# Altium schematic sheet sch_substrate_board_pwr.SchDoc
size A4; SheetNumber: 2; SheetTotal: 6
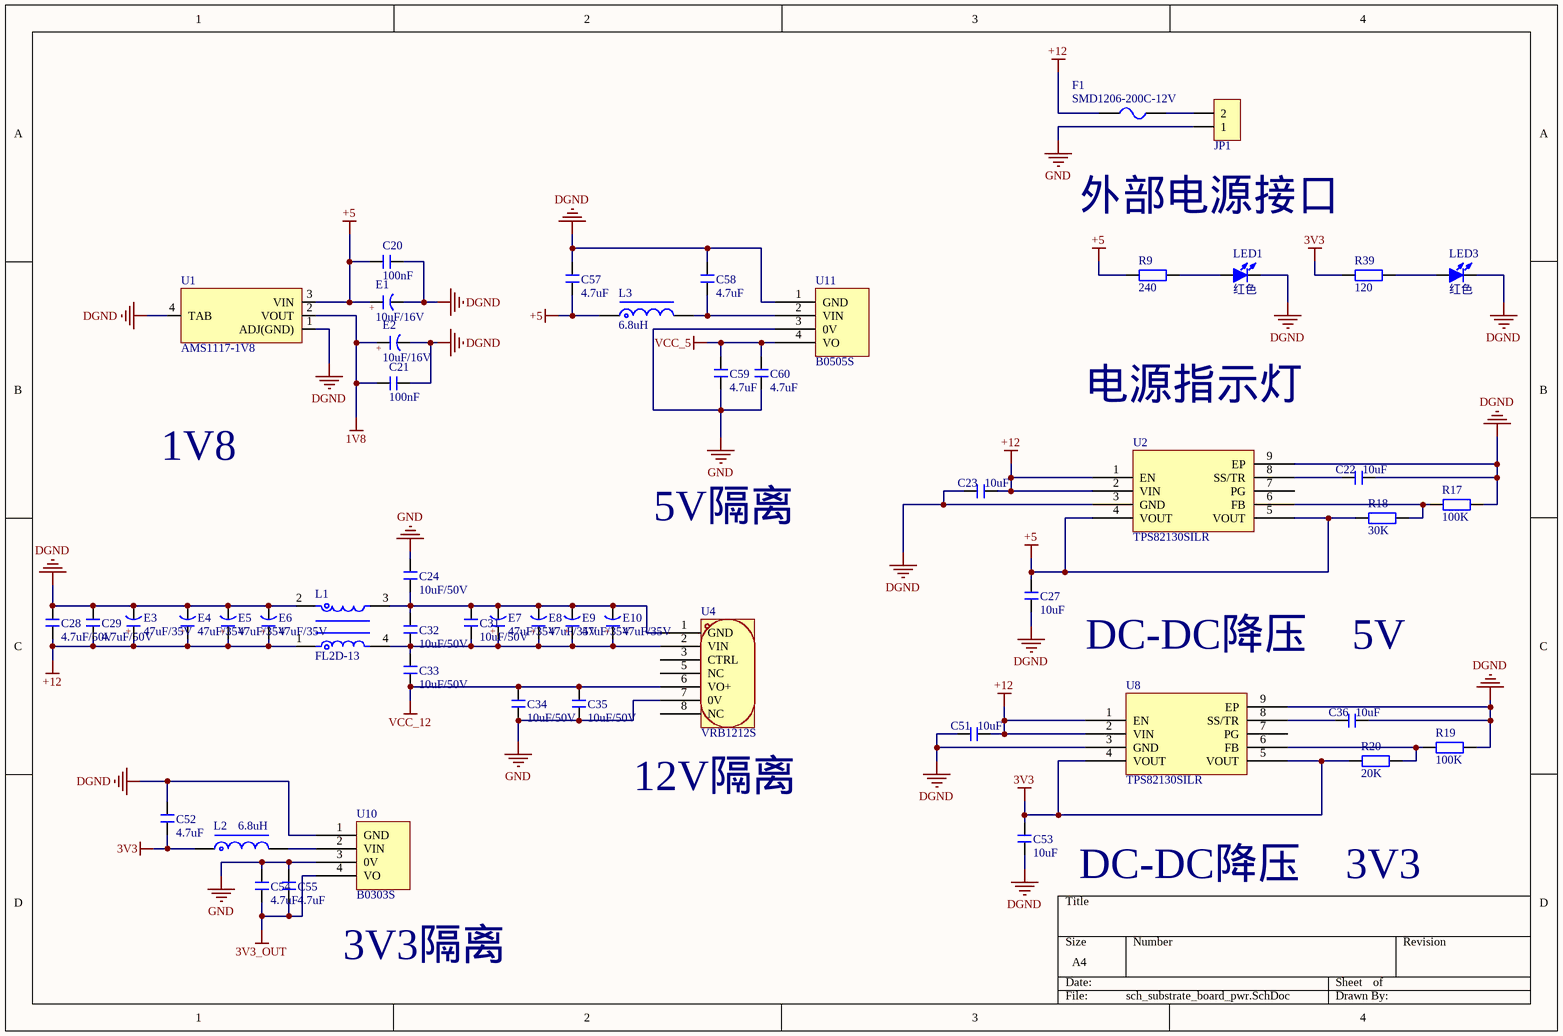
[diagram p0: sch_substrate_board_pwr.SchDoc]

## Parts
C20  100nF  [C 0805_L]
C21  100nF  [C 0805_L]
C22  10uF  [C 0805_L]
C23  10uF  [C 0805_L]
C24  10uF/50V  [CAP-SMD_L8.0-W6.0-LS11.4]
C27  10uF  [C 0805_L]
C28  4.7uF/50V  [C 0805_L]
C29  4.7uF/50V  [C 0805_L]
C31  10uF/50V  [C 0805_L]
C32  10uF/50V  [C 0805_L]
C33  10uF/50V  [CAP-SMD_L8.0-W6.0-LS11.4]
C34  10uF/50V  [C 0805_L]
C35  10uF/50V  [C 0805_L]
C36  10uF  [C 0805_L]
C51  10uF  [C 0805_L]
C52  4.7uF  [C 0805_L]
C53  10uF  [C 0805_L]
C54  4.7uF  [C 0805_L]
C55  4.7uF  [C 0805_L]
C57  4.7uF  [C 0805_L]
C58  4.7uF  [C 0805_L]
C59  4.7uF  [C 0805_L]
C60  4.7uF  [C 0805_L]
E1  10uF/16V  [CD A(3216)]
E2  10uF/16V  [CD A(3216)]
E3  47uF/35V  [CD D(7343)]
E4  47uF/35V  [CD D(7343)]
E5  47uF/35V  [CD D(7343)]
E6  47uF/35V  [CD D(7343)]
E7  47uF/35V  [CD D(7343)]
E8  47uF/35V  [CD D(7343)]
E9  47uF/35V  [CD D(7343)]
E10  47uF/35V  [CD D(7343)]
F1  SMD1206-200C-12V  [FU 1206]
JP1  HDR-1X2  [KF350-2P]  (value not drawn)
L1  FL2D-13  [FL2D-13]
L2  6.8uH  [- duplicate]
L3  6.8uH  [- duplicate]
LED1  红色  [LED 0805R]
LED3  红色  [LED 0805R]
R9  240  [R 0805_L]
R17  100K  [R 0805_L]
R18  30K  [R 0805_L]
R19  100K  [R 0805_L]
R20  20K  [R 0805_L]
R39  120  [R 0805_L]
U1  AMS1117-1V8  [AMS1117]
U2  TPS82130SILR  [TPS82130SILR]
U4  VRB1212S  [VRB1205S]
U8  TPS82130SILR  [TPS82130SILR]
U10  B0303S  [B0303S]
U11  B0505S  [B0505S]

## Nets
1V8: C21.1 E2.1(A) U1.2(VOUT)
3V3: C52.2 C53.2 L2.1 R20.1 R39.2 U8.4(VOUT) U8.5(VOUT)
3V3_OUT: C54.2 C55.2 U10.4(VO)
+5: C20.1 C27.2 C57.1 E1.1(A) L3.1 R9.2 R18.1 U1.3(VIN) U2.4(VOUT) U2.5(VOUT)
+12: C23.2 C28.1 C29.1 C51.2 E3.1(A) E4.1(A) E5.1(A) E6.1(A) F1.1 L1.1 U2.1(EN) U2.2(VIN) U8.1(EN) U8.2(VIN)
DGND: C20.2 C21.2 C22.2 C23.1 C27.1 C28.2 C29.2 C36.2 C51.1 C52.1 C53.1 C57.2 C58.2 E1.2(K) E2.2(K) E3.2(K) E4.2(K) E5.2(K) E6.2(K) L1.2 LED1.2(K) LED3.2(K) R17.2 R19.2 U1.1(ADJ(GND)) U1.4(TAB) U2.3(GND) U2.9(EP) U8.3(GND) U8.9(EP) U10.1(GND) U11.1(GND)
GND: C24.2 C34.1 C35.1 C54.1 C55.1 C59.2 C60.2 JP1.1 U4.7(0V) U10.3(0V) U11.3(0V)
VCC_5: C59.1 C60.1 U11.4(VO)
VCC_12: C33.2 C34.2 C35.2 U4.6(VO+)
NetC22_1: C22.1 U2.8(SS/TR)
NetC24_1: C24.1 C31.2 C32.2 E7.2(K) E8.2(K) E9.2(K) E10.2(K) L1.3 U4.1(GND)
NetC31_1: C31.1 C32.1 C33.1 E7.1(A) E8.1(A) E9.1(A) E10.1(A) L1.4 U4.2(VIN)
NetC36_1: C36.1 U8.8(SS/TR)
NetC58_1: C58.1 L3.2 U11.2(VIN)
NetF1_2: F1.2 JP1.2
NetL2_2: L2.2 U10.2(VIN)
NetLED1_1: LED1.1(A) R9.1
NetLED3_1: LED3.1(A) R39.1
NetR17_1: R17.1 R18.2 U2.6(FB)
NetR19_1: R19.1 R20.2 U8.6(FB)

Not connected (* = marked no-connect by the designer): U2 7(PG); U4 3(CTRL) 5(NC) 8(NC); U8 7(PG)

## Notes on the sheet
- 外部电源接口
- 电源指示灯
- 1V8
- 5V隔离
- DC-DC降压    5V
- (near U4) 12V隔离
- DC-DC降压    3V3
- 3V3隔离
- (in symbol CT) +

## Library data of the parts
C20-C24 C27-C29 C31-C36 C51-C55 C57-C60 = C: 贴片电容; BOM名称: 无极性贴片电容; 淘宝ID: 封装库来自淘宝 ID：黄晶宝石; 联系售后，技术支持: https://shop463601444.taobao.com; 唯一出售店铺网址: https://shop463601444.taobao.com
E1-E10 = CT: 贴片钽电容; 淘宝ID: 封装库来自淘宝 ID：黄晶宝石; BOM名称: 贴片钽电容; 联系售后: https://item.taobao.com/item.htm?id=566775463719
F1 = FU: 贴片保险丝; 版权归属: 封装库来自淘宝卖家 ID：黄晶宝石; BOM名称: 贴片保险丝; 学习资源: https://shop463601444.taobao.com
JP1 = Header 2: 2P接插件; 版权归属: 封装库来自淘宝卖家 ID：黄晶宝石; BOM名称: 2P接插件; 技术支持，联系售后: https://shop463601444.taobao.com
L1 = FL2D-13: 共模滤波器
L2 L3 = L-MR: 功率磁环电感; 淘宝ID: 封装库来自淘宝 ID：黄晶宝石; BOM名称: 功率磁环电感; 联系售后: https://item.taobao.com/item.htm?id=566775463719
LED1 LED3 = LED-SMD: 贴片LED; 版权归属: 封装库来自淘宝 ID：黄晶宝石; BOM名称: 贴片LED; 学习资源: https://item.taobao.com/item.htm?id=566775463719
R9 R17-R20 R39 = R: 贴片电阻; 版权归属: 来自淘宝 ID：黄晶宝石; 封装库来自淘宝卖家 ID：黄晶宝石: 其他店铺购入均为盗版，不享受售后技术支持服务，请立即申请退款; BOM名称: 贴片电阻; 联系售后: https://item.taobao.com/item.htm?id=566775463719
U1 = AMS1117: 电源稳压芯片
U2 U8 = TPS82130SILR: DC-DC
U4 = VRB1205S-6WR31: 电源隔离芯片
U10 = B0303S: IC
U11 = B0505S: 电源隔离